# Altium schematic sheet BB_BME680.SchDoc
size A4
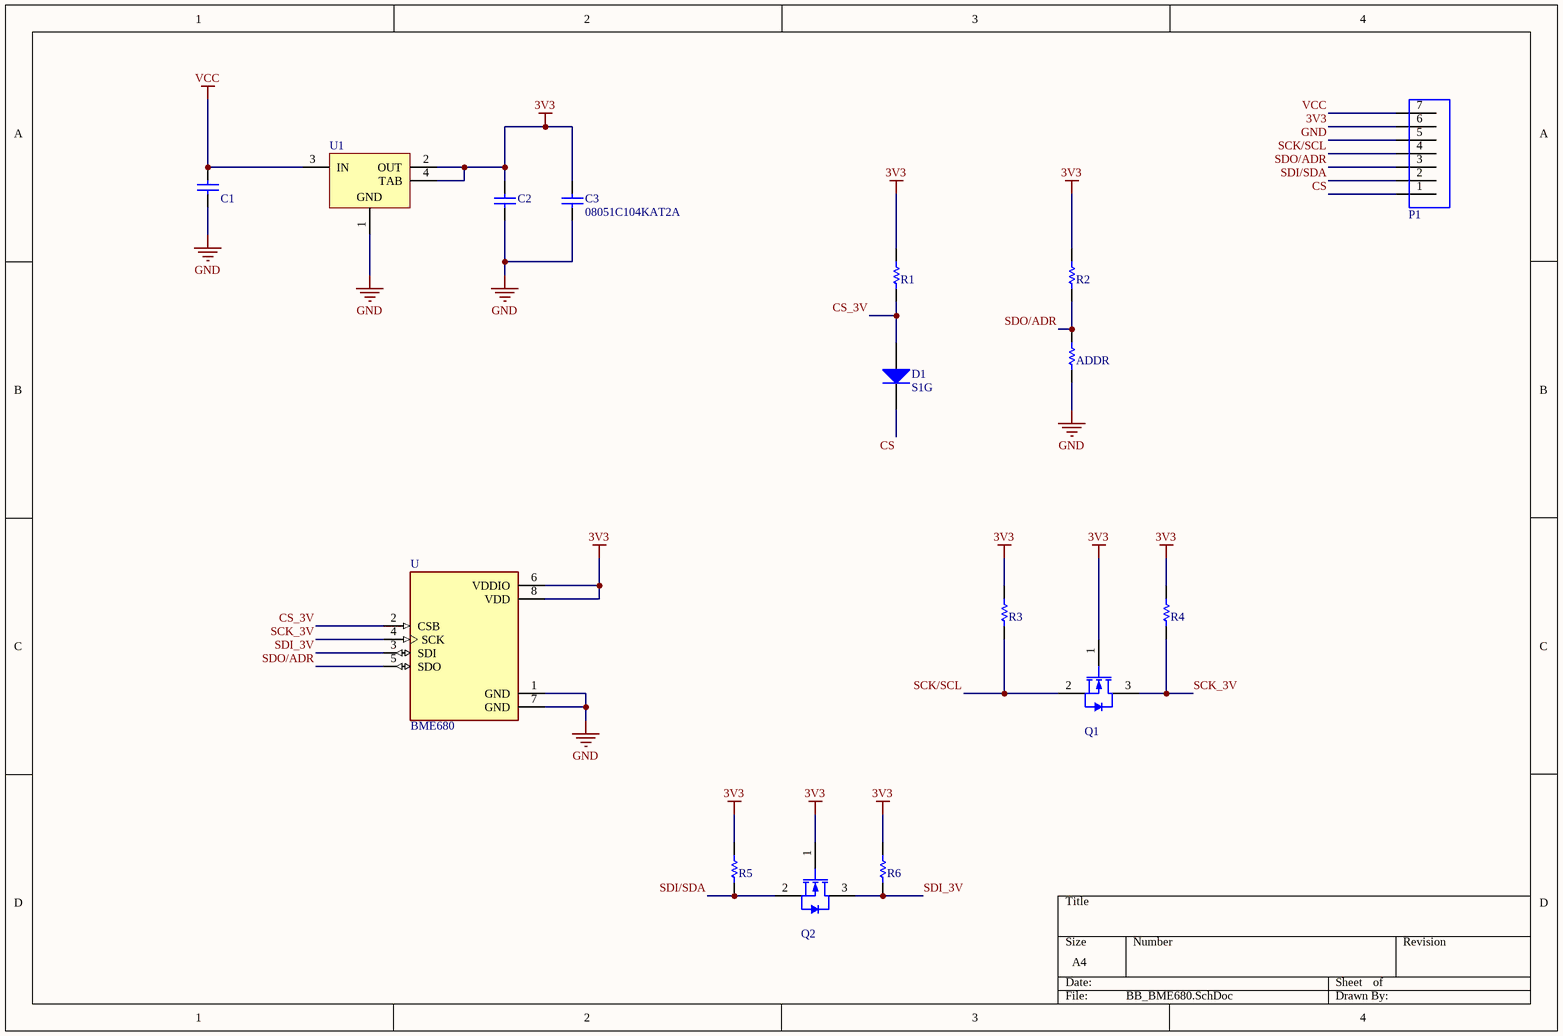
[diagram p0: BB_BME680.SchDoc]

## Parts
ADDR  JUMPER  [RESC2013X60X30ML20T20]  (value not drawn)
C1  C0805C106K4PACTU  [CAPC2013X140X50ML20T25]  (value not drawn)
C2  C0805C106K4PACTU  [CAPC2013X140X50ML20T25]  (value not drawn)
C3  08051C104KAT2A  [CAPC2013X94X50ML20T25]
D1  S1G  [FAIR-DO-214AC-2_V]
P1  PIN_HEADER_7  [PIN_HEADER_7]  (value not drawn)
Q1  BSS138-7-F  [DIOD-SOT23-3_V]  (value not drawn)
Q2  BSS138-7-F  [DIOD-SOT23-3_V]  (value not drawn)
R1  RK73B2ATTD103J  [RESC2013X60X30ML20T20]  (value not drawn)
R2  RK73B2ATTD103J  [RESC2013X60X30ML20T20]  (value not drawn)
R3  RK73B2ATTD103J  [RESC2013X60X30ML20T20]  (value not drawn)
R4  RK73B2ATTD103J  [RESC2013X60X30ML20T20]  (value not drawn)
R5  RK73B2ATTD103J  [RESC2013X60X30ML20T20]  (value not drawn)
R6  RK73B2ATTD103J  [RESC2013X60X30ML20T20]  (value not drawn)
U  BME680  [BME680]
U1  LM1117MPX-3.3/NOPB  [DCY0004A_L]  (value not drawn)

## Nets
3V3: C2.2 C3.2 P1.6 Q1.1(G) Q2.1(G) R1.1 R2.1 R3.1 R4.1 R5.1 R6.1 U.6(VDDIO) U.8(VDD) U1.2(OUT) U1.4(TAB)
GND: ADDR.2 C1.2 C2.1 C3.1 P1.5 U.1(GND) U.7(GND) U1.1(GND)
VCC: C1.1 P1.7 U1.3(IN)
CS: D1.2(K) P1.1
CS_3V: D1.1(A) R1.2 U.2(CSB)
SCK/SCL: P1.4 Q1.2(S) R3.2
SCK_3V: Q1.3(D) R4.2 U.4(SCK)
SDI/SDA: P1.2 Q2.2(S) R5.2
SDI_3V: Q2.3(D) R6.2 U.3(SDI)
SDO/ADR: ADDR.1 P1.3 R2.2 U.5(SDO)

## Library data of the parts
ADDR = CMP-2001-04657-1: 10 kOhms ±5% 0.25W, 1/4W Chip Resistor 0805 (2012 Metric) Automotive AEC-Q200, Moisture Resistant Thick Film; Part Number: RK73B2ATTD103J; Manufacturer: KOA Speer
C1 C2 = CMP-2007-03242-1: 10µF ±10% 16V Ceramic Capacitor X5R 0805 (2012 Metric); Part Number: CL21A106KOQNNNG
C3 = CMP-2007-04174-1: Manufacturer: AVX Interconnect / Elco; Part Number: 08051C104KAT2A
D1 = CMP-2000-07011-1: General Purpose Rectifier, 1.4 W, -55 to 150 degC, 2-Pin DO-214AC, RoHS, Tape and Reel; Manufacturer: Fairchild Semiconductor; Reverse Recovery Time-Max: 1.8µs; Forward Voltage: 1.1V; Trr: 1800ns; VRRM Max: 400V; Power Dissipation Max: 1400mW; Average Rectified Current-Max: 1A; Reverse Current-Max: 1µA; Mounting Technology: SurfaceMount; Manufacturer URL: https://www.fairchildsemi.com/; Package URL: https://www.fairchildsemi.com/package-drawings/DO/DO214AC.pdf; Datasheet URL: https://www.fairchildsemi.com/datasheets/S1/S1G.pdf; Package Description: 2-Pin Surface Mount Device, Body 4.375 x 2.725 mm; Reverse Voltage-Max [Vrrm]: 400V; Package Reference: DO-214AC-2; Datasheet Version: Rev. 2.10, 05/2015; PartNumber: S1G
Q1 Q2 = CMP-2000-04930-1: N-Channel Enhancement Mode Mosfet, 50 V, 0.2 A, -55 to 150 degC, 3-Pin SOT23, RoHS, Tape and Reel; Manufacturer: Diodes Inc; Brand: DiodesIncorporated; Unit Weight: 0.000282oz; Pd - Power Dissipation: 300mW; Id - Continuous Drain Current: 200mA; Rds On - Drain-Source Resistance: 3.5Ohms; Vgs - Gate-Source Voltage: 20V; Number of Channels: 1Channel; Vds - Drain-Source Breakdown Voltage: 50V; Transistor Type: 1N-Channel; Typical Turn-Off Delay Time: 20ns; Configuration: Single; Mounting Style: SMD/SMT; Height: 1mm; Package Description: 3-Pin Small Outline Transistor, Body 2.9 x 1.3 mm, Pitch 0.96 mm; Datasheet Version: Rev. 20-2, 11/2013; Minimum Operating Temperature: -55C; Package / Case: SOT-23-3; Channel Mode: Enhancement; Product: MOSFETSmallSignal; Packaging: Reel; Maximum Operating Temperature: +150C; Datasheet URL: https://datasheet.ciiva.com/8115/ds30144-8115344.pdf; Product Category: MOSFET; Width: 1.3mm; Technology: Si; Package Reference: SOT23-3; Manufacturer URL: http://www.diodes.com/; Transistor Polarity: N-Channel; Length: 2.9mm; Factory Pack Quantity: 3000; Series: BSS138; RoHS: True; Typical Turn-On Delay Time: 20ns
R1-R6 = CMP-2001-04657-1: 10 kOhms ±5% 0.25W, 1/4W Chip Resistor 0805 (2012 Metric) Automotive AEC-Q200, Moisture Resistant Thick Film; Manufacturer: KOA Speer; Part Number: RK73B2ATTD103J
U = BME680: Gas, Humidity, Pressure, Temperature Sensor IÂ²C, SPI Output; MF: Bosch Sensortec; Package: LGA-8 Bosch Tools; MP: BME680; Value: *; Availability: Unavailable; Price: None; SnapEDA_Link: https://www.snapeda.com/parts/BME680/Bosch%20Sensortec/view-part/947201/?ref=snap
U1 = CMP-0062-01639-4: 800mA Low-Dropout Linear Regulator, 4-pin SOT-223, Pb-Free; Manufacturer: Texas Instruments; High-Reliability: Y; PowerWise: N; PackageTopMarking: XYTT*N05A; CompType: LDO IC; ComponentLink1URL: http://www.ti.com/general/docs/lit/getliterature.tsp?genericPartNumber=LM1117-N&fileType=pdf; PartNumber: LM1117MPX-3.3/NOPB; ComponentLink1Description: Datasheet URL; PinCount: 4; Code_JEDEC: TO-261-AA; PackageDescription: Molded SOT-223, 6.50 x 3.56 x 1.6mm Body, 4 Lead, 2.3mm Pitch; PackageReference: DCY0004A; RoHS: Y; Code_IPC: SOT223-4